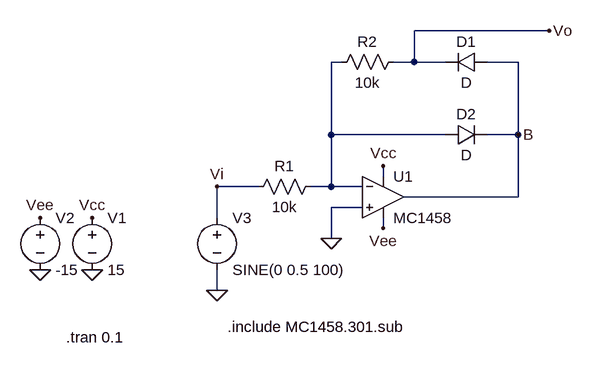
[diagram p0: schematic kadai1-3.asc]
kadai1-3.asc, the LTspice schematic file:
Version 4
SHEET 1 880 680
WIRE 752 -160 544 -160
WIRE 432 -112 416 -112
WIRE 544 -112 544 -160
WIRE 544 -112 512 -112
WIRE 592 -112 544 -112
WIRE 704 -112 656 -112
WIRE 416 0 416 -112
WIRE 592 0 416 0
WIRE 704 0 704 -112
WIRE 704 0 656 0
WIRE 496 64 496 48
WIRE 304 80 240 80
WIRE 416 80 416 0
WIRE 416 80 384 80
WIRE 464 80 416 80
WIRE 704 96 704 0
WIRE 704 96 528 96
WIRE 464 112 416 112
WIRE 240 128 240 80
WIRE 496 144 496 128
WIRE 416 160 416 112
WIRE 240 240 240 208
FLAG -32 208 0
FLAG 48 208 0
FLAG 48 128 Vcc
FLAG -32 128 Vee
FLAG 240 240 0
FLAG 496 48 Vcc
FLAG 496 144 Vee
FLAG 416 160 0
FLAG 752 -160 Vo
FLAG 240 80 Vi
FLAG 704 0 B
SYMBOL voltage 48 112 R0
SYMATTR InstName V1
SYMATTR Value 15
SYMBOL voltage -32 112 R0
SYMATTR InstName V2
SYMATTR Value -15
SYMBOL voltage 240 112 R0
WINDOW 123 0 0 Left 0
WINDOW 39 0 0 Left 0
SYMATTR InstName V3
SYMATTR Value SINE(0 0.5 100)
SYMBOL res 400 64 R90
WINDOW 0 0 56 VBottom 2
WINDOW 3 32 56 VTop 2
SYMATTR InstName R1
SYMATTR Value 10k
SYMBOL OpAmps\\opamp2 496 32 R0
SYMATTR InstName U1
SYMATTR Value MC1458
SYMBOL res 528 -128 R90
WINDOW 0 0 56 VBottom 2
WINDOW 3 32 56 VTop 2
SYMATTR InstName R2
SYMATTR Value 10k
SYMBOL diode 656 -128 R90
WINDOW 0 0 32 VBottom 2
WINDOW 3 32 32 VTop 2
SYMATTR InstName D1
SYMBOL diode 592 16 R270
WINDOW 0 32 32 VTop 2
WINDOW 3 0 32 VBottom 2
SYMATTR InstName D2
TEXT 8 312 Left 2 !.tran 0.1
TEXT 256 296 Left 2 !.include MC1458.301.sub

The netlist it stands for:
* kadai1-3.asc
V1 Vcc 0 15
V2 Vee 0 -15
V3 Vi 0 SINE(0 0.5 100)
R1 N001 Vi 10k
XU1 0 N001 Vcc Vee B MC1458  ; pins In+ In- V+ V- OUT
R2 Vo N001 10k
D1 B Vo D
D2 N001 B D
.model D D
.lib standard.dio
.tran 0.1
.include MC1458.301.sub
.backanno
.end